# Altium schematic sheet [0X] - SD CARD, SATA.SchDoc
size 513 x 386 mm
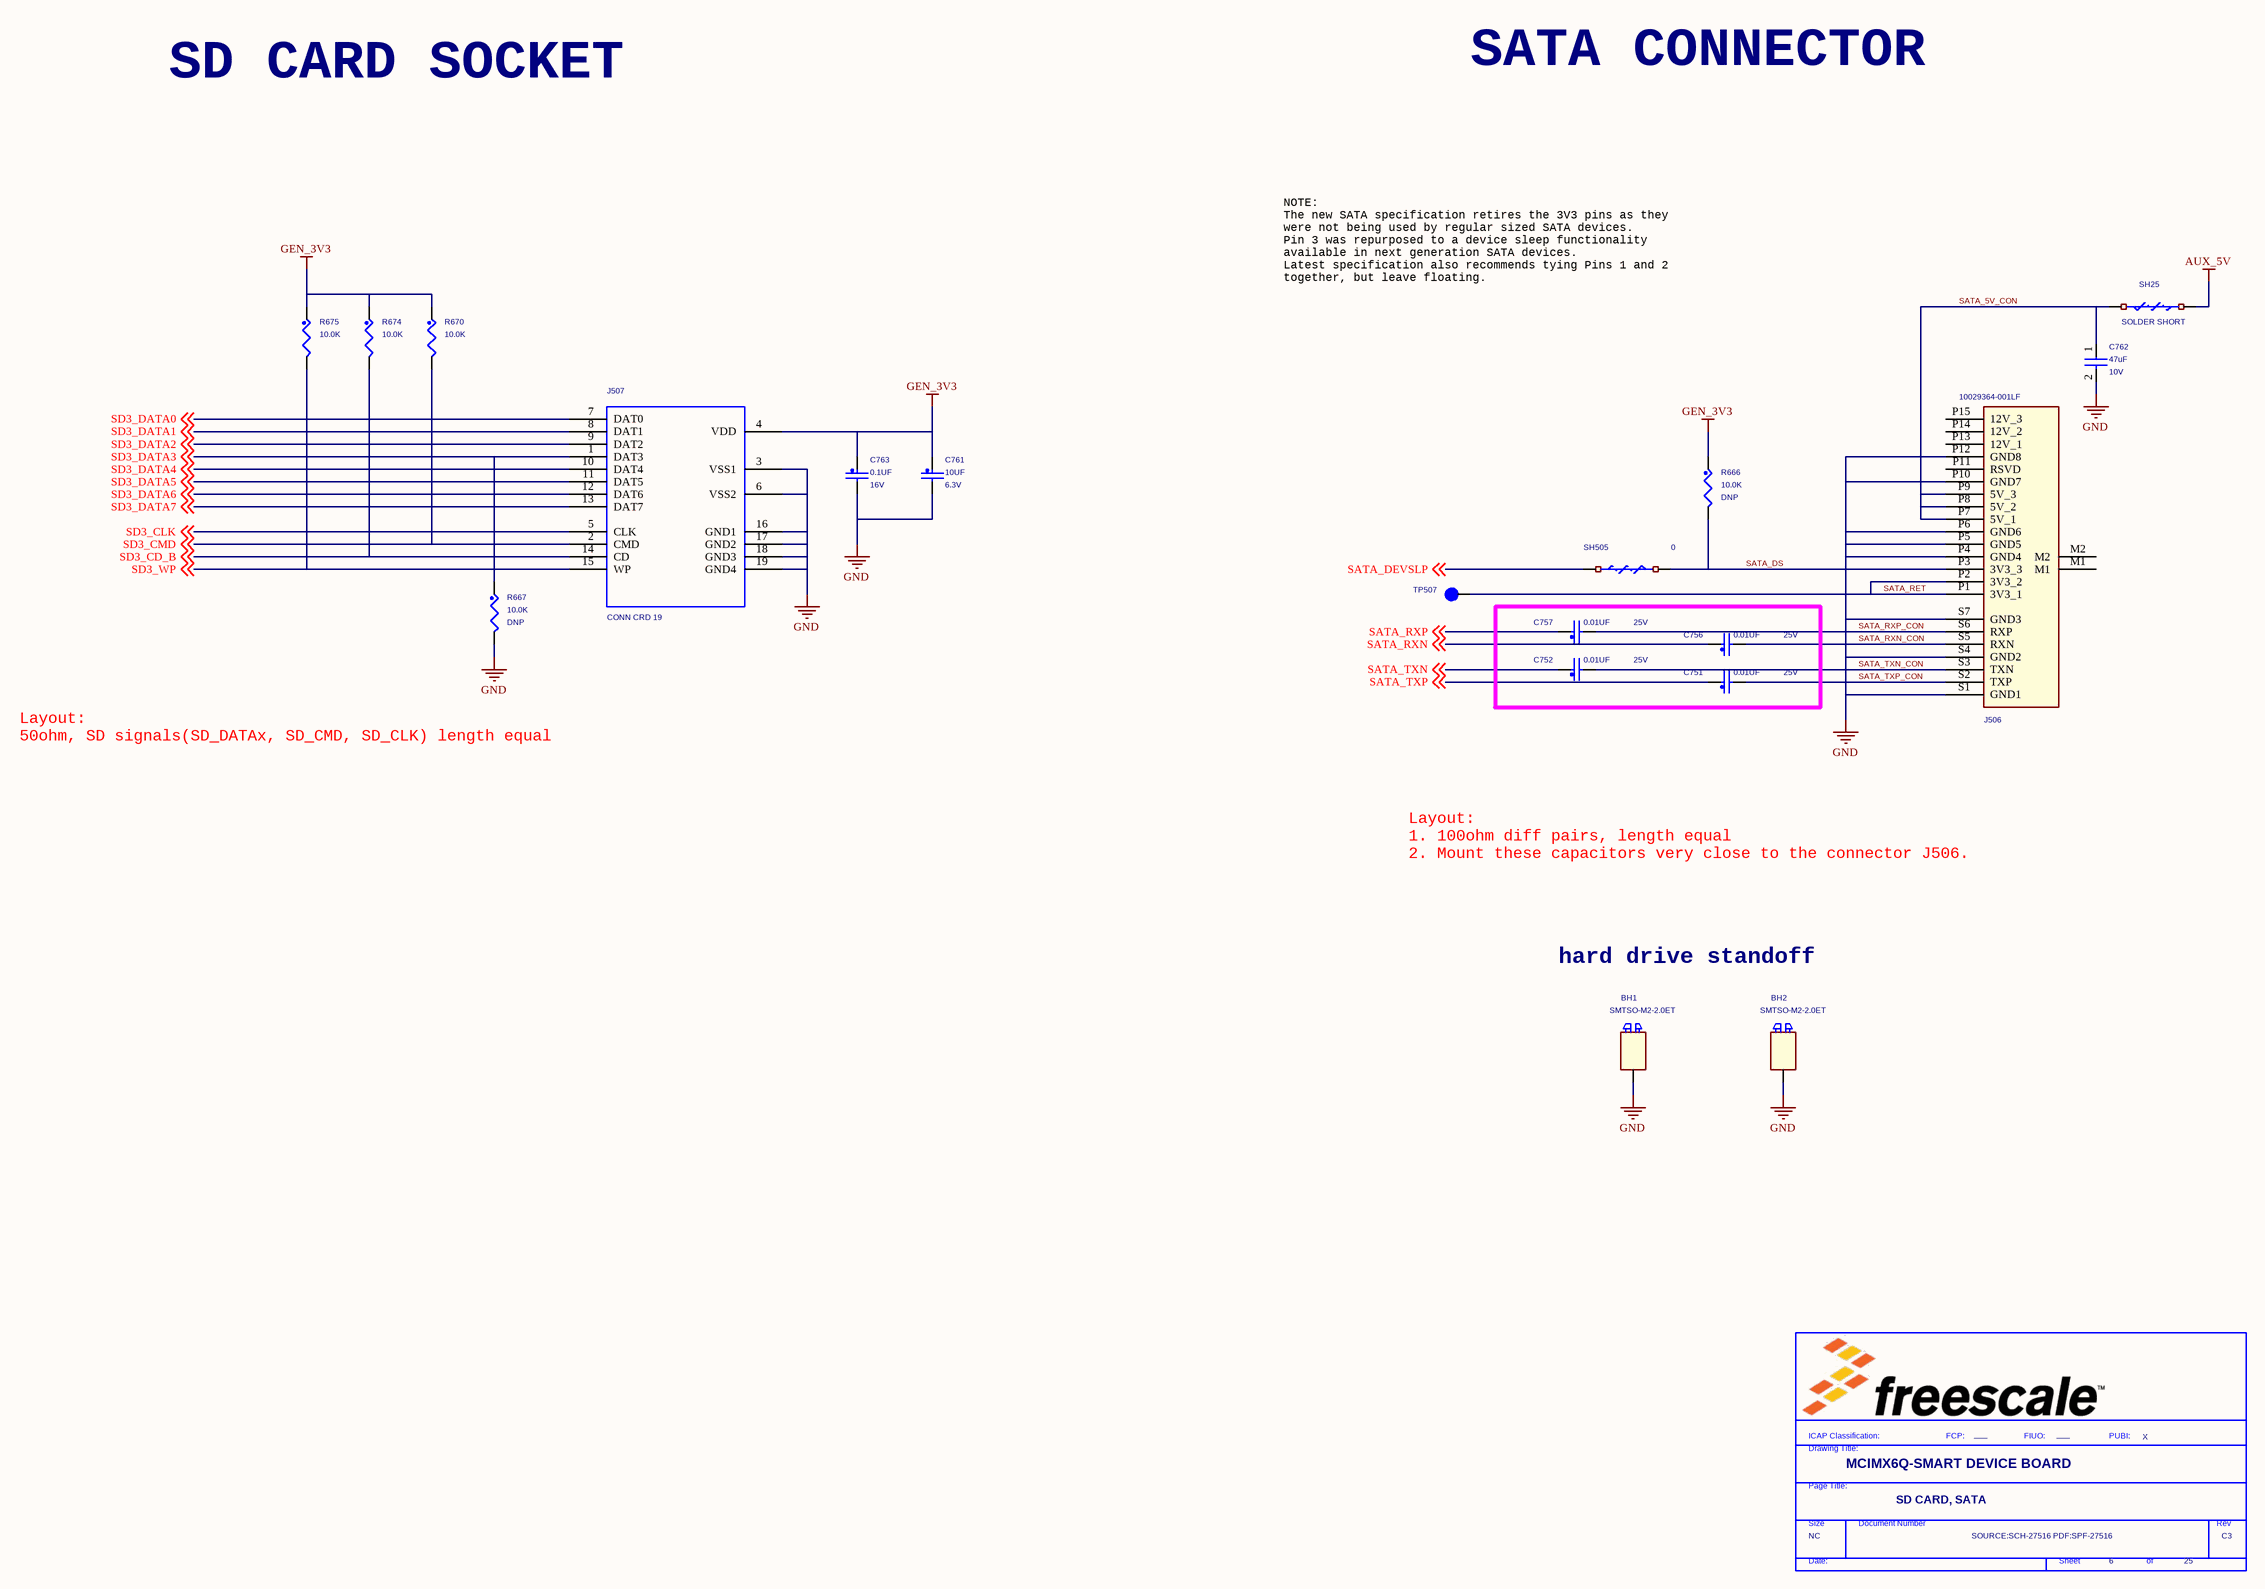
[diagram p0: [0X] - SD CARD, SATA.SchDoc]

## Parts
*  FIUO: ___  PUBI: X  Doc: SOURCE:SCH-27516 PDF:SPF-27516  RevCode: C3  Title: MCIMX6Q-SMART DEVICE BOARD  Page Size: NC  Page Number: 6  Page Count: 25  PageTitle: SD CARD, SATA  (hidden comment: TitleBlock_FS)  (graphical)
BH1  SMTSO-M2-2.0ET  [mh244-147t]
BH2  SMTSO-M2-2.0ET  [mh244-147t]
C751  0.01UF  WVDC: 25V  [0201_CC]
C752  0.01UF  WVDC: 25V  [0201_CC]
C756  0.01UF  WVDC: 25V  [0201_CC]
C757  0.01UF  WVDC: 25V  [0201_CC]
C761  10UF  WVDC: 6.3V  [0603_CC]
C762  47uF  WVDC: 10V  [1206_CC]
C763  0.1UF  WVDC: 16V  [0402_CC]
J506  10029364-001LF  [con_sata_22f_50_sm_ra_a]
J507  CONN CRD 19  [con19_sdcard_28x16_sm]
R666  10.0K  ASSY_OPT: DNP  [0402_CC]
R667  10.0K  ASSY_OPT: DNP  [0402_CC]
R670  10.0K  [0402_CC]
R674  10.0K  [0402_CC]
R675  10.0K  [0402_CC]
SH25  SOLDER SHORT  [SH0805_40]
SH505  0  [SH0603_CC]
TP507  tpad_020  [tpad_020]  (value not drawn)

## Nets
AUX_5V: SH25.1
GEN_3V3: C761.1 C763.1 J507.4(VDD) R666.1 R670.1 R674.1 R675.1
GND: BH1.1(NC_1) BH2.1(NC_1) C761.2 C762.2 C763.2 J506.P4(GND4) J506.P5(GND5) J506.P6(GND6) J506.P10(GND7) J506.P12(GND8) J506.S1(GND1) J506.S4(GND2) J506.S7(GND3) J507.3(VSS1) J507.6(VSS2) J507.16(GND1) J507.17(GND2) J507.18(GND3) J507.19(GND4) R667.2
SATA_5V_CON: C762.1 J506.P7(5V_1) J506.P8(5V_2) J506.P9(5V_3) SH25.2
SATA_DEVSLP: SH505.1 ; off-sheet SATA_DEVSLP
SATA_DS: J506.P3(3V3_3) R666.2 SH505.2
SATA_RET: J506.P1(3V3_1) J506.P2(3V3_2) TP507.1(Pin1)
SATA_RXN: C756.1 ; off-sheet SATA_RXN
SATA_RXN_CON: C756.2 J506.S5(RXN)
SATA_RXP: C757.1 ; off-sheet SATA_RXP
SATA_RXP_CON: C757.2 J506.S6(RXP)
SATA_TXN: C752.1 ; off-sheet SATA_TXN
SATA_TXN_CON: C752.2 J506.S3(TXN)
SATA_TXP: C751.1 ; off-sheet SATA_TXP
SATA_TXP_CON: C751.2 J506.S2(TXP)
SD3_CD_B: J507.14(CD) R674.2 ; off-sheet SD3_CD_B
SD3_CLK: J507.5(CLK) ; off-sheet SD3_CLK
SD3_CMD: J507.2(CMD) R670.2 ; off-sheet SD3_CMD
SD3_DATA0: J507.7(DAT0) ; off-sheet SD3_DATA0
SD3_DATA1: J507.8(DAT1) ; off-sheet SD3_DATA1
SD3_DATA2: J507.9(DAT2) ; off-sheet SD3_DATA2
SD3_DATA3: J507.1(DAT3) R667.1 ; off-sheet SD3_DATA3
SD3_DATA4: J507.10(DAT4) ; off-sheet SD3_DATA4
SD3_DATA5: J507.11(DAT5) ; off-sheet SD3_DATA5
SD3_DATA6: J507.12(DAT6) ; off-sheet SD3_DATA6
SD3_DATA7: J507.13(DAT7) ; off-sheet SD3_DATA7
SD3_WP: J507.15(WP) R675.2 ; off-sheet SD3_WP

Not connected (* = marked no-connect by the designer): J506 M1 M2 P11(RSVD) P13(12V_1) P14(12V_2) P15(12V_3)

## Notes on the sheet
- SD CARD SOCKET
- SATA CONNECTOR
- NOTE:
  The new SATA specification retires the 3V3 pins as they
  were not being used by regular sized SATA devices.
  Pin 3 was repurposed to a device sleep functionality
  available in next generation SATA devices.
  Latest specification also recommends tying Pins 1 and 2
  together, but leave floating.
- Layout:
  50ohm, SD signals(SD_DATAx, SD_CMD, SD_CLK) length equal
- Layout:
  1. 100ohm diff pairs, length equal
  2. Mount these capacitors very close to the connector J506.
- hard drive standoff
- (in symbol TitleBlock_FS) ICAP Classification:; FCP:; FIUO:; PUBI:; Drawing Title:; Page Title:; Size; Document Number; Rev; Date:; Sheet; of

## Library data of the parts
* = TitleBlock_FS: OrgAddr2: Austin, TX 78735-8598; OrgAddr1: 6501 William Cannon Drive West; OrgName: Freescale Semiconductor; FCP: ___; Page Create Date: March  8, 1995
BH1 BH2 = SPACER: FASTENER, STANDOFF M2 THR 2.0MM L; CLASS: IC; MFG_NAME01: PEM FASTENERS; AGILE_PN: 280-76627; HEIGHT: 0.5 MM; ROHS: Yes; MFG_PN01: SMTSO-M2-2.0ET
C751 C756 = CAP_NP: CAP CER 0.01UF 6.3V 10% X7R 0201; CLASS: DISCRETE; AGILE_PN: 150-75465; MFG_NAME01: MURATA; MFG_PN01: GRM033R70J103KA01D; CAD_APPROVED: YES; FPLIST: CC0201,CC0201_HD,0201_CC,cc_0201_cir; SIGNAL_MODEL: DEFAULT_CAPACITOR_10000pF_2_1; Tolerance: 10%; ROHS: Yes; HEIGHT: 0.33 MM; VOLTAGE: 6.3V
C752 C757 = CAP_NP: CAP CER 0.01UF 6.3V 10% X7R 0201; CLASS: DISCRETE; FPLIST: CC0201,CC0201_HD,0201_CC,cc_0201_cir; CAD_APPROVED: YES; MFG_PN01: GRM033R70J103KA01D; MFG_NAME01: MURATA; AGILE_PN: 150-75465; SIGNAL_MODEL: DEFAULT_CAPACITOR_10000pF_2_1; HEIGHT: 0.33 MM; ROHS: Yes; Tolerance: 10%; VOLTAGE: 6.3V
C761 = CAP_NP: CAP CER 10UF 6.3V 10% X5R 0603; CLASS: DISCRETE; AGILE_PN: 150-77832; MFG_NAME01: TDK; MFG_PN01: C1608X5R0J106KT; CAD_APPROVED: Yes; FPLIST: CC0603_OV,CC0603,0603_CC; SIGNAL_MODEL: DEFAULT_CAPACITOR_1e+07pF_2_1; Tolerance: 10%; ROHS: Yes; HEIGHT: 1.0MM; VOLTAGE: 6.3V
C762 = MOT_CAP: CAP CER 47uF 10V 20% X5R 1206; CLASS: DISCRETE; FPLIST: CC1206_OV,CC1206,1206_CC; CAD_APPROVED: Yes; MFG_PN01: LMK316BJ476ML-T; MFG_NAME01: TAIYO YUDEN; AGILE_PN: 150-78578; SIGNAL_MODEL: DEFAULT_CAPACITOR_4.7e+07pF_2_1; HEIGHT: 1.80MM; ROHS: Yes; Tolerance: 20%; VOLTAGE: 10V
C763 = CAP_NP: CAP CER 0.1UF 16V 10% X7R 0402; CLASS: DISCRETE; FPLIST: CC0402_25,CC0402_HD,0402_CC; CAD_APPROVED: Yes; MFG_PN01: C0402C104K4RAC; MFG_NAME01: KEMET; AGILE_PN: 150-75182; SIGNAL_MODEL: DEFAULT_CAPACITOR_100000pF_2_1; HEIGHT: 0.635MM; ROHS: Yes; Tolerance: 10%; VOLTAGE: 16V
J506 = CONN_SATA_22P: CON 22 SATA SKT RA SMT 50MIL SP 221H AU; CLASS: IO; AGILE_PN: 211-78930; MFG_NAME01: FCI; CAD_APPROVED: Yes; FPLIST: con_sata_22f_50_sm_ra_a,con_sata_22f_50_sm_ra_b; MFG_PN01: 10029364-001LF; ROHS: Yes; HEIGHT: 5.62MM
J507 = CONN_SDC013_19P: CON 19 CRD SKT SMT -- 150H AU; CLASS: IO; AGILE_PN: 211-76801; MFG_NAME01: PROCONN TECHNOLOGY CO., LTD; MFG_PN01: SDC013-A0-501F; CAD_APPROVED: Yes; ROHS: Yes; HEIGHT: 3.80 MM
R666 R670 R674 R675 = RES: RES MF 10.0K 1/16W 1% 0402; CLASS: DISCRETE; FPLIST: RC0402_25,RC0402_HD,0402_CC; CAD_APPROVED: Yes; MFG_PN01: CRCW040210K0FKED; MFG_NAME01: VISHAY INTERTECHNOLOGY; AGILE_PN: 470-75416; SIGNAL_MODEL: DEFAULT_RESISTOR_10000OHM_2_1; ROHS: Yes; Tolerance: 1%
R667 = RES: RES MF 10.0K 1/16W 1% 0402; CLASS: DISCRETE; AGILE_PN: 470-75416; MFG_NAME01: VISHAY INTERTECHNOLOGY; MFG_PN01: CRCW040210K0FKED; CAD_APPROVED: Yes; FPLIST: RC0402_25,RC0402_HD,0402_CC; SIGNAL_MODEL: DEFAULT_RESISTOR_10000OHM_2_1; Tolerance: 1%; ROHS: Yes
SH25 = RES_SHORT-2: SOLDER SHORT 0805  SMT NO PART TO ORDER; CLASS: DISCRETE; AGILE_PN: 470-80202; MFG_NAME01: NOTACOMPONENT; MFG_PN01: SOLDER_SHORT_0805; ASSY_OPT: DNP; CAD_APPROVED: Yes; FPLIST: SH0805,SH0805CUST,SH0805_40; ROHS: Yes
SH505 = RES_SHORT-2: ZERO OHM CUT TRACE 0603 PADS; NO PART TO ORDER; CLASS: DISCRETE; SIGNAL_MODEL: DEFAULT_RESISTOR_0.001OHM_2_1; AGILE_PN: 470-80018; MFG_NAME01: LAYOUT ELEMENT ONLY; ASSY_OPT: DNP; CAD_APPROVED: Yes; FPLIST: SH0603,SH0603_CC,SH0603-X2_PIN1TO2,SH0603-X2_PIN2TO3; MFG_PN01: LAYOUT ELEMENT ONLY; ROHS: Yes
TP507 = TESTLOOP: TEST POINT PAD 0.5MM DIA SMT, NO PART TO ORDER; CLASS: IO; AGILE_PN: 211-77484; ASSY_OPT: DNP; CAD_APPROVED: Yes; ROHS: Yes; HEIGHT: 0.1MM